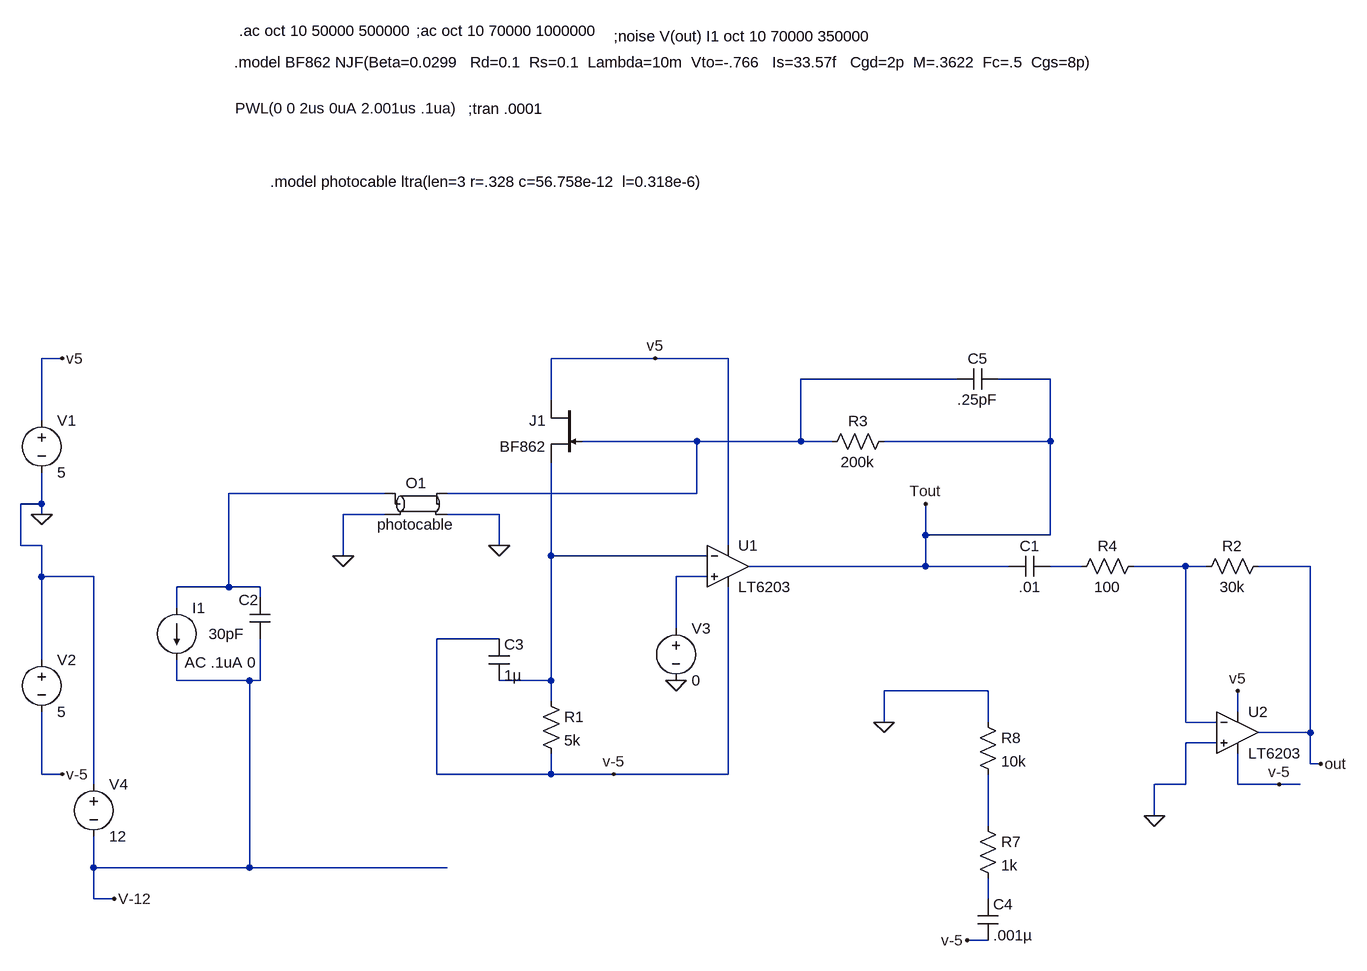
[diagram p0: schematic 6203 wsign wave&cable&bootstrap_4_21_10_1BW analysis.asc]
6203 wsign wave&cable&bootstrap_4_21_10_1BW analysis.asc, the LTspice schematic file:
Version 4
SHEET 1 3232 872
WIRE -256 -256 -288 -256
WIRE 656 -256 496 -256
WIRE 768 -256 656 -256
WIRE 1120 -224 880 -224
WIRE 1264 -224 1184 -224
WIRE 496 -192 496 -256
WIRE -288 -160 -288 -256
WIRE 720 -128 544 -128
WIRE 880 -128 880 -224
WIRE 880 -128 720 -128
WIRE 928 -128 880 -128
WIRE 1264 -128 1264 -224
WIRE 1264 -128 1008 -128
WIRE 240 -48 0 -48
WIRE 720 -48 720 -128
WIRE 720 -48 336 -48
WIRE -288 -32 -288 -80
WIRE -288 -32 -320 -32
WIRE -288 -16 -288 -32
WIRE 240 -16 176 -16
WIRE 416 -16 336 -16
WIRE 1072 16 1072 -32
WIRE 1264 16 1264 -128
WIRE 1264 16 1072 16
WIRE -320 32 -320 -32
WIRE -288 32 -320 32
WIRE 416 32 416 -16
WIRE 768 32 768 -256
WIRE 176 48 176 -16
WIRE 496 48 496 -96
WIRE 736 48 496 48
WIRE 1072 64 1072 16
WIRE 1072 64 800 64
WIRE 1200 64 1072 64
WIRE 1312 64 1264 64
WIRE 1472 64 1392 64
WIRE 1504 64 1472 64
WIRE 1664 64 1584 64
WIRE -288 80 -288 32
WIRE -208 80 -288 80
WIRE 736 80 688 80
WIRE 0 96 0 -48
WIRE 0 96 -80 96
WIRE 48 96 0 96
WIRE 48 112 48 96
WIRE -80 128 -80 96
WIRE 688 160 688 80
WIRE 416 176 320 176
WIRE -288 208 -288 80
WIRE -80 240 -80 208
WIRE 32 240 -80 240
WIRE 48 240 48 176
WIRE 48 240 32 240
WIRE 496 240 496 48
WIRE 496 240 416 240
WIRE 1168 256 1008 256
WIRE 496 272 496 240
WIRE 1552 288 1552 256
WIRE 1008 304 1008 256
WIRE 1168 304 1168 256
WIRE 1472 304 1472 64
WIRE 1520 304 1472 304
WIRE 1664 320 1664 64
WIRE 1664 320 1584 320
WIRE 1520 336 1472 336
WIRE 1664 368 1664 320
WIRE 1680 368 1664 368
WIRE -288 384 -288 288
WIRE -256 384 -288 384
WIRE 320 384 320 176
WIRE 496 384 496 352
WIRE 496 384 320 384
WIRE 592 384 496 384
WIRE 768 384 768 96
WIRE 768 384 592 384
WIRE -208 400 -208 80
WIRE 1472 400 1472 336
WIRE 1472 400 1424 400
WIRE 1552 400 1552 352
WIRE 1616 400 1552 400
WIRE 1648 400 1616 400
WIRE 1424 448 1424 400
WIRE 1168 464 1168 384
WIRE -208 528 -208 480
WIRE 32 528 32 240
WIRE 32 528 -208 528
WIRE 336 528 32 528
WIRE -208 576 -208 528
WIRE -176 576 -208 576
WIRE 1168 576 1168 544
WIRE 1168 640 1136 640
FLAG -288 -16 0
FLAG 688 240 0
FLAG 1552 256 v5
FLAG 1680 368 out
FLAG 1616 400 v-5
FLAG -256 -256 v5
FLAG -256 384 v-5
FLAG 656 -256 v5
FLAG 592 384 v-5
FLAG 176 48 0
FLAG 416 32 0
FLAG 1072 -32 Tout
FLAG 1136 640 v-5
FLAG 1008 304 0
FLAG -176 576 V-12
FLAG 1424 448 0
SYMBOL voltage -288 -176 R0
SYMATTR InstName V1
SYMATTR Value 5
SYMBOL current -80 128 R0
WINDOW 3 90 -769 Left 0
WINDOW 123 12 84 Left 0
WINDOW 39 0 0 Left 0
SYMATTR Value PWL(0 0 2us 0uA 2.001us .1ua)
SYMATTR Value2 AC .1uA 0
SYMATTR InstName I1
SYMBOL voltage -288 192 R0
SYMATTR InstName V2
SYMATTR Value 5
SYMBOL cap 32 112 R0
WINDOW 0 -17 4 Left 0
WINDOW 3 -63 56 Left 0
SYMATTR InstName C2
SYMATTR Value 30pF
SYMBOL res 1024 -144 R90
WINDOW 0 0 56 VBottom 0
WINDOW 3 32 56 VTop 0
SYMATTR InstName R3
SYMATTR Value 200k
SYMBOL cap 1184 -240 R90
WINDOW 0 0 32 VBottom 0
WINDOW 3 32 32 VTop 0
SYMATTR InstName C5
SYMATTR Value .25pF
SYMBOL njf 544 -192 M0
SYMATTR InstName J1
SYMATTR Value BF862
SYMBOL res 480 256 R0
SYMATTR InstName R1
SYMATTR Value 5k
SYMBOL Opamps\\LT6203 768 64 R0
SYMATTR InstName U1
SYMBOL voltage 688 144 R0
WINDOW 123 0 0 Left 0
WINDOW 39 0 0 Left 0
SYMATTR InstName V3
SYMATTR Value 0
SYMBOL res 1600 48 R90
WINDOW 0 0 56 VBottom 0
WINDOW 3 32 56 VTop 0
SYMATTR InstName R2
SYMATTR Value 30k
SYMATTR SpiceLine tol=1
SYMBOL res 1408 48 R90
WINDOW 0 0 56 VBottom 0
WINDOW 3 32 56 VTop 0
SYMATTR InstName R4
SYMATTR Value 100
SYMATTR SpiceLine tol=1
SYMBOL Opamps\\LT6203 1552 320 R0
SYMATTR InstName U2
SYMBOL cap 400 176 R0
SYMATTR InstName C3
SYMATTR Value 1µ
SYMBOL ltline 288 -32 R0
SYMATTR InstName O1
SYMATTR Value photocable
SYMBOL cap 1264 48 R90
WINDOW 0 0 32 VBottom 0
WINDOW 3 32 32 VTop 0
SYMATTR InstName C1
SYMATTR Value .01
SYMBOL res 1152 448 R0
SYMATTR InstName R7
SYMATTR Value 1k
SYMBOL res 1152 288 R0
SYMATTR InstName R8
SYMATTR Value 10k
SYMBOL cap 1152 576 R0
SYMATTR InstName C4
SYMATTR Value .001µ
SYMBOL voltage -208 384 R0
WINDOW 123 0 0 Left 0
WINDOW 39 0 0 Left 0
SYMATTR InstName V4
SYMATTR Value 12
TEXT 8 -712 Left 0 !.model BF862 NJF(Beta=0.0299   Rd=0.1  Rs=0.1  Lambda=10m  Vto=-.766   Is=33.57f   Cgd=2p  M=.3622  Fc=.5  Cgs=8p)
TEXT 16 -760 Left 0 !.ac oct 10 50000 500000
TEXT 368 -640 Left 0 !;tran .0001
TEXT 288 -760 Left 0 !;ac oct 10 70000 1000000
TEXT 592 -752 Left 0 !;noise V(out) I1 oct 10 70000 350000
TEXT 64 -528 Left 0 !.model photocable ltra(len=3 r=.328 c=56.758e-12  l=0.318e-6)

The netlist it stands for:
* 6203 wsign wave&cable&bootstrap_4_21_10_1BW analysis.asc
V1 v5 0 5
I1 N002 V-12 PWL(0 0 2us 0uA 2.001us .1ua) AC .1uA 0
V2 0 v-5 5
C2 N002 V-12 30pF
R3 Tout N001 200k
C5 Tout N001 .25pF
J1 v5 N001 N003 BF862
R1 N003 v-5 5k
* U1: LT6203 (symbol Opamps\LT6203 not available, pins judged from their places): In+=N006 In-=N003 V+=v5 V-=v-5 OUT=Tout
V3 N006 0 0
R2 out N005 30k tol=1
R4 N005 N004 100 tol=1
* U2: LT6203 (symbol Opamps\LT6203 not available, pins judged from their places): In+=0 In-=N005 V+=v5 V-=v-5 OUT=out
C3 v-5 N003 1µ
O1 N002 0 N001 0 photocable
C1 N004 Tout .01
R7 N007 N008 1k
R8 0 N007 10k
C4 N008 v-5 .001µ
V4 0 V-12 12
.model NJF NJF
.model PJF PJF
.lib standard.jft
.model BF862 NJF(Beta=0.0299   Rd=0.1  Rs=0.1  Lambda=10m  Vto=-.766   Is=33.57f   Cgd=2p  M=.3622  Fc=.5  Cgs=8p)
.ac oct 10 50000 500000
;tran .0001
;ac oct 10 70000 1000000
;noise V(out) I1 oct 10 70000 350000
.model photocable ltra(len=3 r=.328 c=56.758e-12  l=0.318e-6)
.backanno
.end